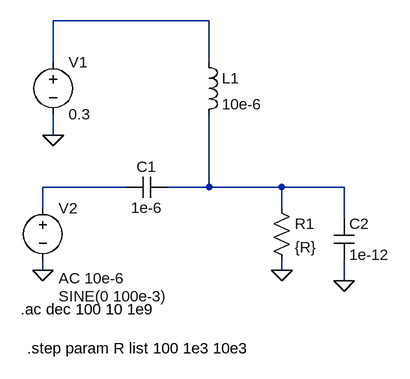
[diagram p0: schematic BiasTee.asc]
BiasTee.asc, the LTspice schematic file:
Version 4
SHEET 1 880 680
WIRE 240 -64 0 -64
WIRE 0 0 0 -64
WIRE 240 0 240 -64
WIRE 0 112 0 80
WIRE 112 192 -16 192
WIRE 240 192 240 80
WIRE 240 192 176 192
WIRE 352 192 240 192
WIRE 448 192 352 192
WIRE -16 224 -16 192
WIRE 352 224 352 192
WIRE 448 240 448 192
WIRE -16 320 -16 304
WIRE 352 320 352 304
WIRE 448 336 448 304
FLAG 0 112 0
FLAG -16 320 0
FLAG 352 320 0
FLAG 448 336 0
SYMBOL ind 224 -16 R0
SYMATTR InstName L1
SYMATTR Value 10e-6
SYMBOL cap 176 176 R90
WINDOW 0 0 32 VBottom 2
WINDOW 3 32 32 VTop 2
SYMATTR InstName C1
SYMATTR Value 1e-6
SYMBOL voltage 0 -16 R0
WINDOW 123 0 0 Left 0
WINDOW 39 0 0 Left 0
SYMATTR InstName V1
SYMATTR Value 0.3
SYMBOL voltage -16 208 R0
WINDOW 3 24 152 Left 2
WINDOW 123 24 124 Left 2
WINDOW 39 0 0 Left 0
SYMATTR InstName V2
SYMATTR Value SINE(0 100e-3)
SYMATTR Value2 AC 10e-6
SYMBOL res 336 208 R0
SYMATTR InstName R1
SYMATTR Value {R}
SYMBOL cap 432 240 R0
SYMATTR InstName C2
SYMATTR Value 1e-12
TEXT -50 380 Left 2 !.ac dec 100 10 1e9
TEXT -40 440 Left 2 !.step param R list 100 1e3 10e3

The netlist it stands for:
* BiasTee.asc
L1 N001 N003 10e-6
C1 N003 N002 1e-6
V1 N001 0 0.3
V2 N002 0 SINE(0 100e-3) AC 10e-6
R1 N003 0 {R}
C2 N003 0 1e-12
.ac dec 100 10 1e9
.step param R list 100 1e3 10e3
.backanno
.end